# Altium schematic sheet STM32G473RET6_PINOUT.SchDoc
size C; SheetNumber: 11; SheetTotal: 11
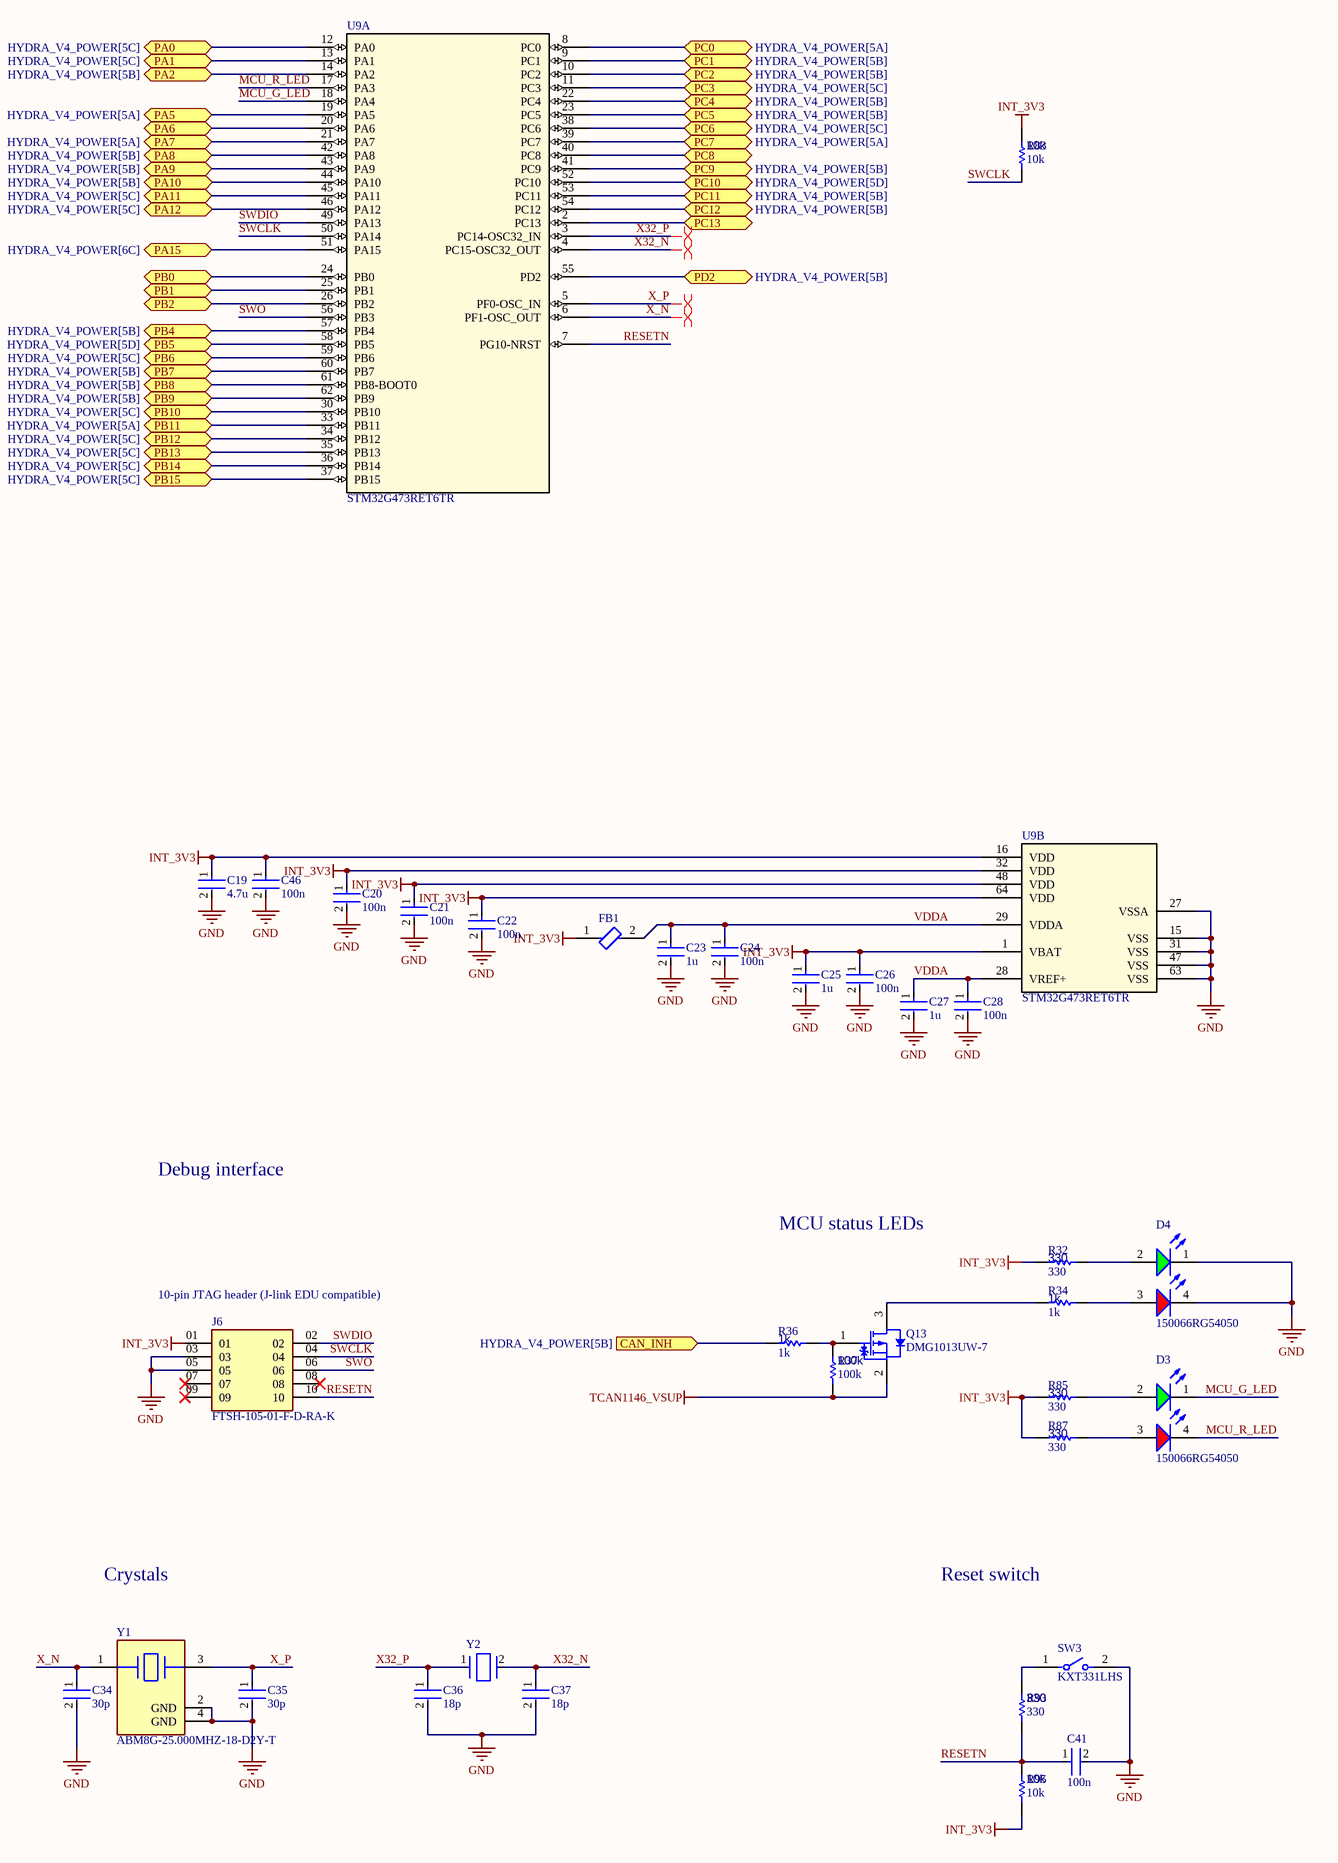
[diagram p0: STM32G473RET6_PINOUT.SchDoc]

## Parts
C19  4.7u  [FP-0402-L_1_0_0_05-W_0_5-IPC_A]
C20  100n  [FP-0402-L_1_0_0_05-W_0_5-IPC_A]
C21  100n  [FP-0402-L_1_0_0_05-W_0_5-IPC_A]
C22  100n  [FP-0402-L_1_0_0_05-W_0_5-IPC_A]
C23  1u  [FP-0402-L_1_0_0_05-W_0_5-IPC_A]
C24  100n  [FP-0402-L_1_0_0_05-W_0_5-IPC_A]
C25  1u  [FP-0402-L_1_0_0_05-W_0_5-IPC_A]
C26  100n  [FP-0402-L_1_0_0_05-W_0_5-IPC_A]
C27  1u  [FP-0402-L_1_0_0_05-W_0_5-IPC_A]
C28  100n  [FP-0402-L_1_0_0_05-W_0_5-IPC_A]
C34  30p  [FP-0402-L_1_0_0_05-W_0_5-IPC_A]
C35  30p  [FP-0402-L_1_0_0_05-W_0_5-IPC_A]
C36  18p  [FP-0402-L_1_0_0_05-W_0_5-IPC_A]
C37  18p  [FP-0402-L_1_0_0_05-W_0_5-IPC_A]
C41  100n  [FP-0402-L_1_0_0_05-W_0_5-IPC_A]
C46  100n  [FP-0402-L_1_0_0_05-W_0_5-IPC_A]
D3  150066RG54050  [WL-SBCD_0606]
D4  150066RG54050  [WL-SBCD_0606]
FB1  BLM15PX601SN1D  [FP-BLM15-0_05-MFG]  (value not drawn)
J6  FTSH-105-01-F-D-RA-K  [FTSH-105-01-F-D-RA-K-Footprint-1]
Q13  DMG1013UW-7  [DIOD-SOT323-3_V]
R32  330  [R0603B]
R34  1k  [R0603B]
R36  1k  [R0603B]
R37  100k  [R0603B]
R83  10k  [R0603B]
R85  330  [R0603B]
R87  330  [R0603B]
R93  330  [R0603B]
R95  10k  [R0603B]
SW3  KXT331LHS  [FP-KXT331LHS-MFG]
U9  STM32G473RET6TR  [STM32G473RET6TR-Footprint-1]  (parts A,B of 2)
Y1  ABM8G-25.000MHZ-18-D2Y-T  [FP-ABM8G-MFG]
Y2  ECS-.327-12.5-1210-TR  [FP-ECX-1210-MFG]  (value not drawn)

## Ports
CAN_INH (in, see HYDRA_V4_POWER[5B]), PA0 (bidir, see HYDRA_V4_POWER[5C]), PA1 (bidir, see HYDRA_V4_POWER[5C]), PA2 (bidir, see HYDRA_V4_POWER[5B]), PA5 (bidir, see HYDRA_V4_POWER[5A]), PA6 (bidir), PA7 (bidir, see HYDRA_V4_POWER[5A]), PA8 (bidir, see HYDRA_V4_POWER[5B]), PA9 (bidir, see HYDRA_V4_POWER[5B]), PA10 (bidir, see HYDRA_V4_POWER[5B]), PA11 (bidir, see HYDRA_V4_POWER[5C]), PA12 (bidir, see HYDRA_V4_POWER[5C]), PA15 (bidir, see HYDRA_V4_POWER[6C]), PB0 (bidir), PB1 (bidir), PB2 (bidir), PB4 (bidir, see HYDRA_V4_POWER[5B]), PB5 (bidir, see HYDRA_V4_POWER[5D]), PB6 (bidir, see HYDRA_V4_POWER[5C]), PB7 (bidir, see HYDRA_V4_POWER[5B]), PB8 (bidir, see HYDRA_V4_POWER[5B]), PB9 (bidir, see HYDRA_V4_POWER[5B]), PB10 (bidir, see HYDRA_V4_POWER[5C]), PB11 (bidir, see HYDRA_V4_POWER[5A]), PB12 (bidir, see HYDRA_V4_POWER[5C]), PB13 (bidir, see HYDRA_V4_POWER[5C]), PB14 (bidir, see HYDRA_V4_POWER[5C]), PB15 (bidir, see HYDRA_V4_POWER[5C]), PC0 (bidir, see HYDRA_V4_POWER[5A]), PC1 (bidir, see HYDRA_V4_POWER[5B]), PC2 (bidir, see HYDRA_V4_POWER[5B]), PC3 (bidir, see HYDRA_V4_POWER[5C]), PC4 (bidir, see HYDRA_V4_POWER[5B]), PC5 (bidir, see HYDRA_V4_POWER[5B]), PC6 (bidir, see HYDRA_V4_POWER[5C]), PC7 (bidir, see HYDRA_V4_POWER[5A]), PC8 (bidir), PC9 (bidir, see HYDRA_V4_POWER[5B]), PC10 (bidir, see HYDRA_V4_POWER[5D]), PC11 (bidir, see HYDRA_V4_POWER[5B]), PC12 (bidir, see HYDRA_V4_POWER[5B]), PC13 (bidir), PD2 (bidir, see HYDRA_V4_POWER[5B])

## Nets
GND: C19.2 C20.2 C21.2 C22.2 C23.2 C24.2 C25.2 C26.2 C27.2 C28.2 C34.2 C35.2 C36.2 C37.2 C41.2 C46.2 D4.1(K) D4.4(K) J6.03 J6.05 SW3.2 U9.15(VSS) U9.27(VSSA) U9.31(VSS) U9.47(VSS) U9.63(VSS) Y1.2(GND) Y1.4(GND)
INT_3V3: C19.1 C20.1 C21.1 C22.1 C25.1 C26.1 C46.1 FB1.1 J6.01 R32.2 R83.2 R85.2 R87.2 R95.1 U9.1(VBAT) U9.16(VDD) U9.32(VDD) U9.48(VDD) U9.64(VDD)
TCAN1146_VSUP: Q13.2(S) R37.2
CAN_INH: R36.2 ; port CAN_INH
MCU_G_LED: D3.1(K) U9.18(PA4)
MCU_R_LED: D3.4(K) U9.17(PA3)
PA0: U9.12(PA0) ; port PA0
PA1: U9.13(PA1) ; port PA1
PA2: U9.14(PA2) ; port PA2
PA5: U9.19(PA5) ; port PA5
PA6: U9.20(PA6) ; port PA6
PA7: U9.21(PA7) ; port PA7
PA8: U9.42(PA8) ; port PA8
PA9: U9.43(PA9) ; port PA9
PA10: U9.44(PA10) ; port PA10
PA11: U9.45(PA11) ; port PA11
PA12: U9.46(PA12) ; port PA12
PA15: U9.51(PA15) ; port PA15
PB0: U9.24(PB0) ; port PB0
PB1: U9.25(PB1) ; port PB1
PB2: U9.26(PB2) ; port PB2
PB4: U9.57(PB4) ; port PB4
PB5: U9.58(PB5) ; port PB5
PB6: U9.59(PB6) ; port PB6
PB7: U9.60(PB7) ; port PB7
PB8: U9.61(PB8-BOOT0) ; port PB8
PB9: U9.62(PB9) ; port PB9
PB10: U9.30(PB10) ; port PB10
PB11: U9.33(PB11) ; port PB11
PB12: U9.34(PB12) ; port PB12
PB13: U9.35(PB13) ; port PB13
PB14: U9.36(PB14) ; port PB14
PB15: U9.37(PB15) ; port PB15
PC0: U9.8(PC0) ; port PC0
PC1: U9.9(PC1) ; port PC1
PC2: U9.10(PC2) ; port PC2
PC3: U9.11(PC3) ; port PC3
PC4: U9.22(PC4) ; port PC4
PC5: U9.23(PC5) ; port PC5
PC6: U9.38(PC6) ; port PC6
PC7: U9.39(PC7) ; port PC7
PC8: U9.40(PC8) ; port PC8
PC9: U9.41(PC9) ; port PC9
PC10: U9.52(PC10) ; port PC10
PC11: U9.53(PC11) ; port PC11
PC12: U9.54(PC12) ; port PC12
PC13: U9.2(PC13) ; port PC13
PD2: U9.55(PD2) ; port PD2
RESETN: C41.1 J6.10 R93.1 R95.2 U9.7(PG10-NRST)
SWCLK: J6.04 R83.1 U9.50(PA14)
SWDIO: J6.02 U9.49(PA13)
SWO: J6.06 U9.56(PB3)
VDDA: C23.1 C24.1 C27.1 C28.1 FB1.2 U9.28(VREF+) U9.29(VDDA)
X32_N: C37.1 U9.4(PC15-OSC32_OUT) Y2.2(Out/In)
X32_P: C36.1 U9.3(PC14-OSC32_IN) Y2.1(In/Out)
X_N: C34.1 U9.6(PF1-OSC_OUT) Y1.1
X_P: C35.1 U9.5(PF0-OSC_IN) Y1.3
NetD3_2: D3.2(A) R85.1
NetD3_3: D3.3(A) R87.1
NetD4_2: D4.2(A) R32.1
NetD4_3: D4.3(A) R34.1
NetQ13_1: Q13.1(G) R36.1 R37.1
NetQ13_3: Q13.3(D) R34.2
NetR93_2: R93.2 SW3.1

Not connected (* = marked no-connect by the designer): J6 07* 08* 09*

## Layout directives
differential pair: X32_N, X32_P, X_N, X_P

## Notes on the sheet
- Debug interface
- MCU status LEDs
- (near J6) 10-pin JTAG header (J-link EDU compatible)
- Crystals
- Reset switch

## Library data of the parts
C19-C28 C34-C37 C41 C46 = CMP-001-00058-1: LARGE PADS, 0402 CAP, CHANGE COMMENT TO MATCH REAL P/N; Capacitor Type: Ceramic; Min Operating Temperature: -55°C; Mounting Technology: Surface Mount; Pins: 2; Case/Package: 0402; RoHS Compliant: Yes; Max Operating Temperature: 85°C
  C19: Value: 4.7u
  C20-C22 C24 C26 C28 C41 C46: Value: 100n
  C23 C25 C27: Value: 1u
  C34 C35: Value: 30p
  C36 C37: Value: 18p
D3 D4 = CMP-004-00040-2: Led, Red/Grn, 180Mcd/230Mcd, 624Nm/525Nm Rohs Compliant: Yes; Source: rgled.SchLib; Component Type: Standard; Design Item ID: CMP-004-00034-2; Pins: 4
FB1 = CMP-0686-00252-4: Chip Ferrite Bead, 0402, 600Ω @ 100MHz, 0.23Ω, 25%, 900mA; Number of Circuits: 1; Impedance: 600R; DC Resistance (DCR): 230mR; Material: Steel; Length: 1mm; Package Quantity: 10000; Height: 0.5mm; Width: 0.5mm; Max DC Current: 900mA; Number of Lines: 1; Termination: SMD/SMT; Packaging: Tape and Reel; Lead Free: Lead Free; Min Operating Temperature: -55°C; Max Operating Temperature: 125°C; Max Current Rating: 900mA; Case Code (Imperial): 0402; Number of Pins: 2; Current Rating: 900mA; Test Frequency: 100MHz; Case/Package: 0402; Tolerance: 25%; Case Code (Metric): 1005
J6 = CMP-002-00041-5: Board Connector, 10 Contact(s), 2 Row(s), Male, Right Angle, 0.05 inch Pitch, Surface Mount Terminal, Locking, Black Insulator; Connector Type: BOARD CONNECTOR; Mounting Technology: Board; RoHS Compliant: Yes
Q13 = CMP-2000-06170-1: P-Channel Enhancement Mode MOSFET, 310 mW, 20 V, -55 to 150 degC, 3-Pin SOT-323, RoHS, Tape and Reel; Manufacturer: Diodes Inc; Qg Gate Charge: 0.622nC; Drain-Source On Resistance-Max: 750mO; Rated Power Dissipation: 310mW; Drain-to-Source Voltage [Vdss]: 20V; Package Reference: SOT323; Datasheet Version: Rev. 3-2, 09/2013; Package Description: 3-Pin Small Outline Transistor, Body 2 x 1.25 mm, Pitch 0.65 mm; Mounting Technology: SurfaceMount; Manufacturer URL: http://www.diodes.com/; Datasheet URL: http://www.diodes.com/_files/datasheets/ds31861.pdf; Channel Type: P-Channel
R32 R34 R36 R37 R83 R85 R87 R93 R95 = CMP-009-00002-14: Resistor
  R32 R85 R87 R93: Value: 330
  R34 R36: Value: 1k
  R37: Value: 100k
  R83 R95: Value: 10k
SW3 = CMP-10040-000029-1: SWITCH TACTILE SPST-NO 0.02A 15V; Operating Force: 240gf; Switch Travel: 0.13mm; Illumination Type: Non-Illuminated; Throw Configuration: SPST; Number of Ports: 1; Current Rating: 5A; Mechanical Life: 500000Cycles; Switch Function: Off-Mom; Connector Type: USB; Actuator Type: Standard; Gender: Receptacle; Number of Contacts: 24; Contact Plating: Gold; Insulation Color: Black; Min Operating Temperature: -40°C; Packaging: Tape and Reel; Flammability Rating: UL94 V-0; Max Operating Temperature: 85°C; Termination: Solder; Mount: Surface Mount
U9 = CMP-020-00020-2: MCU 32-Bit STM32 ARM Cortex-M4 RISC 512KB Flash 1.71V to 3.6V 64-Pin LQFP T/R; RoHS Compliant: Yes
Y1 = CMP-2000-05733-3: Crystal 25MHz ±20ppm (Tol) ±30ppm (Stability) 18pF FUND 60Ω 4-Pin SMD T/R; Series Resistance: 60R; Length: 3.2mm; Depth: 2.5mm; Packaging: Tape and Reel; Min Operating Temperature: -40°C; Operating Frequency: 25 MHz; Lead Free: Lead Free; Number of Pins: 4; Frequency Tolerance: 20ppm; Radiation Hardening: No; Max Operating Temperature: 85°C; Termination: SMD/SMT; Frequency Stability: 30ppm; Frequency: 25MHz; Series: ABM8G; Mount: Surface Mount; Package Quantity: 1000; Height: 0.039inch; Width: 0.098inch; Case/Package: CSMD; ESR (Equivalent Series Resistance): 60R; Load Capacitance: 18pF; Tolerance: 20ppm
Y2 = CMP-40224-000006-1: CRYSTAL 32.7680KHZ 12.5PF SMD; Manufacturer: ECS International; Frequency: 32.768kHz; Esr: 90kΩ; Tolerance: 20ppm; Device Class L1: Passive Components; Load Capacitance: 12.5pF; Temperature: -40°C to +85°C; ComponentLink2URL: https://ecsxtal.com/store/pdf/ECX-1210.pdf; Series: ECX-1210; Octopart: https://octopart.com/ecs-.327-12.5-1210-tr-ecs+international-81221340; ComponentLink2Description: Datasheet; Temperature Range Low: -40°C; Digikey Description: CRYSTAL 32.7680KHZ 12.5PF SMD; Lead Free: Yes; RoHS: TRUE; Device Class L3: Crystals; Automotive: No; Category: Crys; Height: 0.5mm; Manufacturer Part Number: ECS-.327-12.5-1210-TR; Temperature Range High: +85°C; Device Class L2: Crystals / Oscillators; Package: ECX-1210